# Altium project main_board.PrjPCB
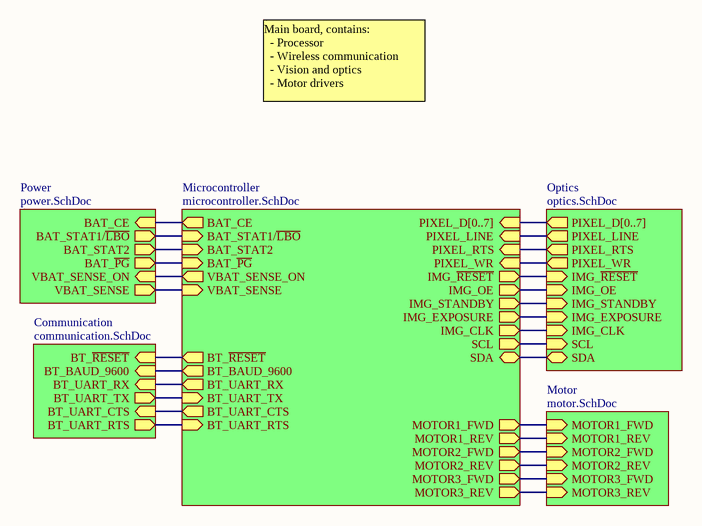
[diagram p0: main_board_interconnect.SchDoc]
6 sheets, 95 parts. Net scope: hierarchical (ports join the sheet entries above them; power ports are global).
Board file: main_board.PcbDoc
Sheets:
  main_board_interconnect.SchDoc
    Microcontroller = microcontroller.SchDoc
    Power = power.SchDoc
    Optics = optics.SchDoc
    Communication = communication.SchDoc
    Motor = motor.SchDoc

## Sheet main_board_interconnect.SchDoc
size A4

### Sub-sheets
Communication = communication.SchDoc: BT_~{RESET} (in), BT_BAUD_9600 (in), BT_UART_RX (in), BT_UART_TX (out), BT_UART_CTS (in), BT_UART_RTS (out)
Microcontroller = microcontroller.SchDoc: BAT_CE (out), BAT_STAT1/~{LBO} (in), BAT_STAT2 (in), BAT_~{PG} (in), VBAT_SENSE_ON (out), VBAT_SENSE (in), BT_~{RESET} (out), BT_BAUD_9600 (out), BT_UART_RX (out), BT_UART_TX (in), BT_UART_CTS (out), BT_UART_RTS (in), MOTOR3_REV (out), MOTOR3_FWD (out), MOTOR2_REV (out), MOTOR2_FWD (out), MOTOR1_REV (out), MOTOR1_FWD (out), PIXEL_D[0..7] (in), PIXEL_LINE (in), PIXEL_RTS (in), PIXEL_WR (in), IMG_~{RESET} (out), IMG_OE (out), IMG_STANDBY (out), IMG_EXPOSURE (out), IMG_CLK (out), SDA (bidir), SCL (out)
Motor = motor.SchDoc: MOTOR3_REV (in), MOTOR3_FWD (in), MOTOR2_REV (in), MOTOR2_FWD (in), MOTOR1_REV (in), MOTOR1_FWD (in)
Optics = optics.SchDoc: PIXEL_D[0..7] (out), PIXEL_LINE (out), PIXEL_RTS (out), PIXEL_WR (out), IMG_~{RESET} (in), IMG_OE (in), IMG_STANDBY (in), IMG_EXPOSURE (in), IMG_CLK (in), SDA (bidir), SCL (in)
Power = power.SchDoc: BAT_CE (in), BAT_STAT1/~{LBO} (out), BAT_STAT2 (out), BAT_~{PG} (out), VBAT_SENSE_ON (in), VBAT_SENSE (out)

### Nets
IMG_CLK: sheet Microcontroller/IMG_CLK, sheet Optics/IMG_CLK
IMG_EXPOSURE: sheet Microcontroller/IMG_EXPOSURE, sheet Optics/IMG_EXPOSURE
PIXEL_WR: sheet Microcontroller/PIXEL_WR, sheet Optics/PIXEL_WR
SCL: sheet Microcontroller/SCL, sheet Optics/SCL
SDA: sheet Microcontroller/SDA, sheet Optics/SDA
NetIC1_4: sheet Microcontroller/BT_BAUD_9600, sheet Communication/BT_BAUD_9600
NetIC1_5: sheet Microcontroller/BT_~{RESET}, sheet Communication/BT_~{RESET}
NetIC1_13: sheet Microcontroller/BT_UART_RX, sheet Communication/BT_UART_RX
NetIC1_14: sheet Microcontroller/BT_UART_TX, sheet Communication/BT_UART_TX
NetIC1_15: sheet Microcontroller/BT_UART_RTS, sheet Communication/BT_UART_RTS
NetIC1_16: sheet Microcontroller/BT_UART_CTS, sheet Communication/BT_UART_CTS
NetIC2_11: sheet Microcontroller/BAT_~{PG}, sheet Power/BAT_~{PG}
NetIC2_12: sheet Microcontroller/BAT_STAT2, sheet Power/BAT_STAT2
NetIC2_13: sheet Microcontroller/BAT_STAT1/~{LBO}, sheet Power/BAT_STAT1/~{LBO}
NetIC2_14: sheet Microcontroller/MOTOR1_FWD, sheet Motor/MOTOR1_FWD
NetIC2_17: sheet Microcontroller/MOTOR1_REV, sheet Motor/MOTOR1_REV
NetIC2_18: sheet Microcontroller/MOTOR2_FWD, sheet Motor/MOTOR2_FWD
NetIC2_21: sheet Microcontroller/MOTOR2_REV, sheet Motor/MOTOR2_REV
NetIC2_22: sheet Microcontroller/MOTOR3_FWD, sheet Motor/MOTOR3_FWD
NetIC2_23: sheet Microcontroller/MOTOR3_REV, sheet Motor/MOTOR3_REV
NetIC2_24: sheet Microcontroller/VBAT_SENSE, sheet Power/VBAT_SENSE
NetIC2_27: sheet Microcontroller/VBAT_SENSE_ON, sheet Power/VBAT_SENSE_ON
NetIC2_28: sheet Microcontroller/BAT_CE, sheet Power/BAT_CE
NetIC2_45: sheet Microcontroller/PIXEL_RTS, sheet Optics/PIXEL_RTS
NetIC2_46: sheet Microcontroller/IMG_OE, sheet Optics/IMG_OE
NetIC2_50: sheet Microcontroller/IMG_~{RESET}, sheet Optics/IMG_~{RESET}
NetIC2_56: sheet Microcontroller/IMG_STANDBY, sheet Optics/IMG_STANDBY
NetIC2_57: sheet Microcontroller/PIXEL_LINE, sheet Optics/PIXEL_LINE

### Buses and harness runs
bus sheet Microcontroller/PIXEL_D[0..7] = sheet Optics/PIXEL_D[0..7]

### Notes on the sheet
- Main board, contains:
  - Processor
  - Wireless communication
  - Vision and optics
  - Motor drivers

## Sheet microcontroller.SchDoc
size A4
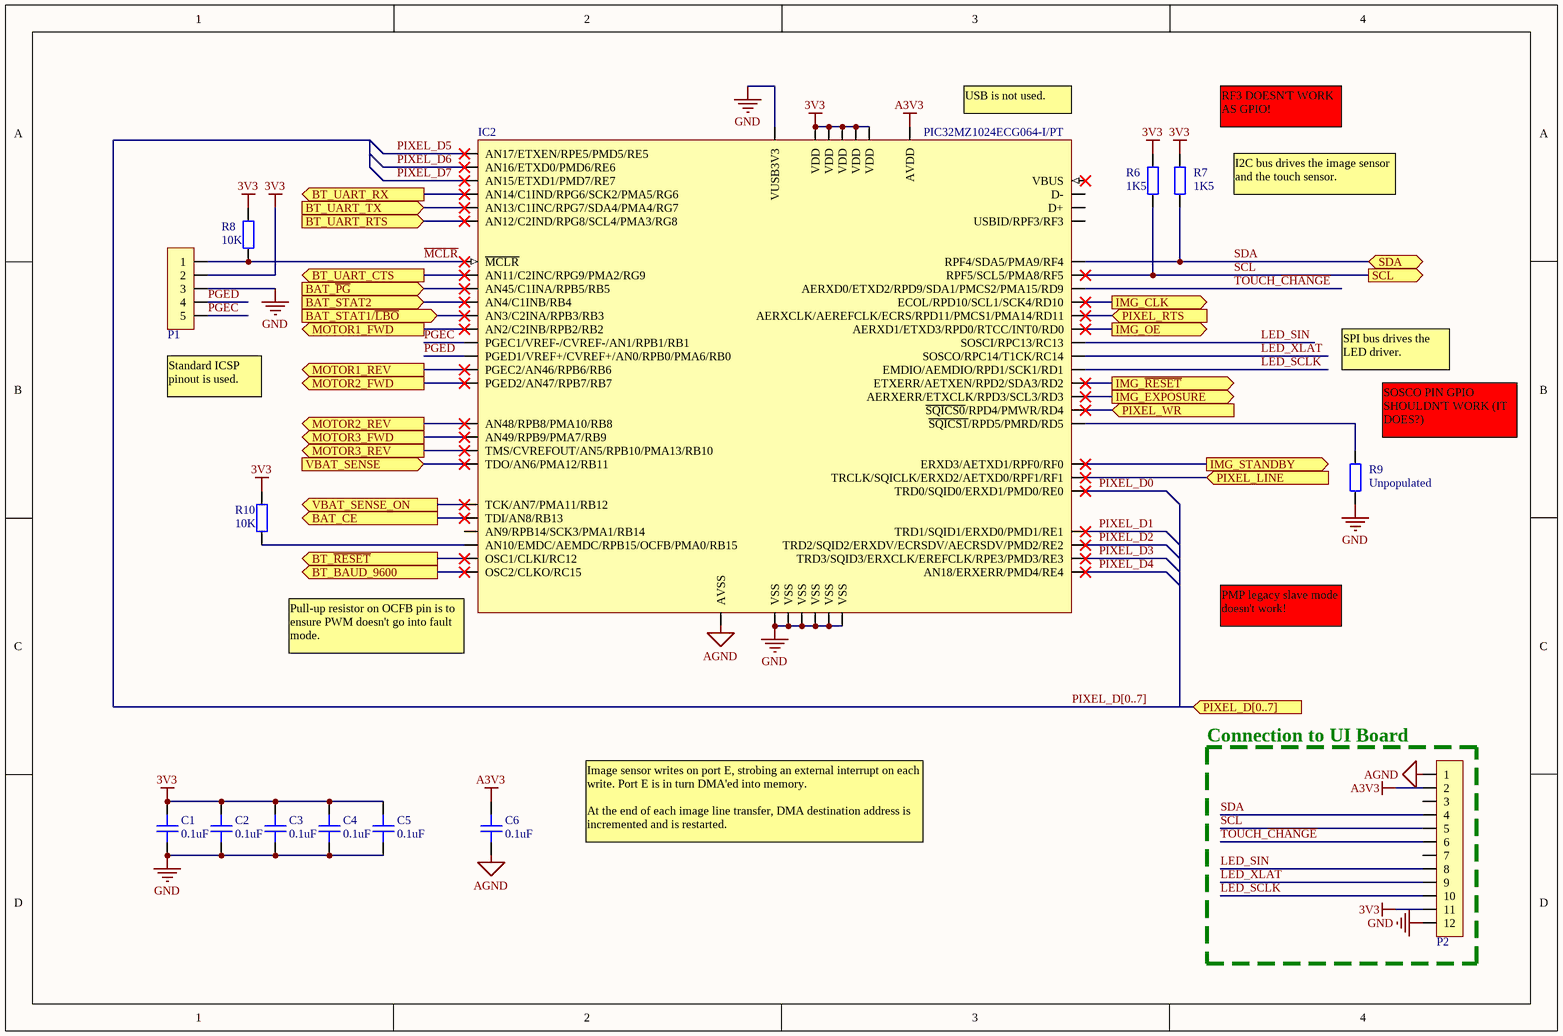
[diagram p1: microcontroller.SchDoc]

### Parts
C1  0.1uF  [1608[0603]_M]
C2  0.1uF  [1608[0603]_M]
C3  0.1uF  [1608[0603]_M]
C4  0.1uF  [1608[0603]_M]
C5  0.1uF  [1608[0603]_M]
C6  0.1uF  [1608[0603]_M]
IC2  PIC32MZ1024ECG064-I/PT  [TQFP-64_M]
P1  Connector 5  [BM05B-SRSS_N]  (value not drawn)
P2  Connector 12  [FH33-12S-0.5SH_N]  (value not drawn)
R6  1K5  [1608[0603]_M]
R7  1K5  [1608[0603]_M]
R8  10K  [1608[0603]_M]
R9  Unpopulated  [1608[0603]_M]
R10  10K  [1608[0603]_M]

### Blocks framed on the sheet
Connection to UI Board: P2

### Ports
BAT_CE (out), BAT_STAT1/~{LBO} (in), BAT_STAT2 (in), BAT_~{PG} (in), BT_BAUD_9600 (out), BT_UART_CTS (out), BT_UART_RTS (in), BT_UART_RX (out), BT_UART_TX (in), BT_~{RESET} (out), IMG_CLK (out), IMG_EXPOSURE (out), IMG_OE (out), IMG_STANDBY (out), IMG_~{RESET} (out), MOTOR1_FWD (out), MOTOR1_REV (out), MOTOR2_FWD (out), MOTOR2_REV (out), MOTOR3_FWD (out), MOTOR3_REV (out), PIXEL_D[0..7] (in), PIXEL_LINE (in), PIXEL_RTS (in), PIXEL_WR (in), SCL (out), SDA (bidir), VBAT_SENSE (in), VBAT_SENSE_ON (out)

### Nets
3V3: C1.2 C2.2 C3.2 C4.2 C5.2 IC2.8(VDD) IC2.26(VDD) IC2.39(VDD) IC2.54(VDD) IC2.60(VDD) P1.2 P2.11 R6.2 R7.2 R8.2 R10.2
A3V3: C6.2 IC2.19(AVDD) P2.2
AGND: C6.1 IC2.20(AVSS) P2.1
GND: C1.1 C2.1 C3.1 C4.1 C5.1 IC2.7(VSS) IC2.25(VSS) IC2.34(VUSB3V3) IC2.35(VSS) IC2.40(VSS) IC2.55(VSS) IC2.59(VSS) P1.3 P2.12 R9.1
IMG_CLK: IC2.44(ECOL/RPD10/SCL1/SCK4/RD10) ; port IMG_CLK
IMG_EXPOSURE: IC2.51(AERXERR/ETXCLK/RPD3/SCL3/RD3) ; port IMG_EXPOSURE
LED_SCLK: IC2.49(EMDIO/AEMDIO/RPD1/SCK1/RD1) P2.10
LED_SIN: IC2.47(SOSCI/RPC13/RC13) P2.8
LED_XLAT: IC2.48(SOSCO/RPC14/T1CK/RC14) P2.9
~{MCLR}: IC2.9(~{MCLR}) P1.1 R8.1
PGEC: IC2.15(PGEC1/VREF-/CVREF-/AN1/RPB1/RB1) P1.5
PGED: IC2.16(PGED1/VREF+/CVREF+/AN0/RPB0/PMA6/RB0) P1.4
PIXEL_D0: IC2.58(TRD0/SQID0/ERXD1/PMD0/RE0)
PIXEL_D1: IC2.61(TRD1/SQID1/ERXD0/PMD1/RE1)
PIXEL_D2: IC2.62(TRD2/SQID2/ERXDV/ECRSDV/AECRSDV/PMD2/RE2)
PIXEL_D3: IC2.63(TRD3/SQID3/ERXCLK/EREFCLK/RPE3/PMD3/RE3)
PIXEL_D4: IC2.64(AN18/ERXERR/PMD4/RE4)
PIXEL_D5: IC2.1(AN17/ETXEN/RPE5/PMD5/RE5)
PIXEL_D6: IC2.2(AN16/ETXD0/PMD6/RE6)
PIXEL_D7: IC2.3(AN15/ETXD1/PMD7/RE7)
PIXEL_WR: IC2.52(~{SQICS0}/RPD4/PMWR/RD4) ; port PIXEL_WR
SCL: IC2.42(RPF5/SCL5/PMA8/RF5) P2.5 R6.1 ; port SCL
SDA: IC2.41(RPF4/SDA5/PMA9/RF4) P2.4 R7.1 ; port SDA
TOUCH_~{CHANGE}: IC2.43(AERXD0/ETXD2/RPD9/SDA1/PMCS2/PMA15/RD9) P2.6
NetIC1_4: IC2.32(OSC2/CLKO/RC15) ; port BT_BAUD_9600
NetIC1_5: IC2.31(OSC1/CLKI/RC12) ; port BT_~{RESET}
NetIC1_13: IC2.4(AN14/C1IND/RPG6/SCK2/PMA5/RG6) ; port BT_UART_RX
NetIC1_14: IC2.5(AN13/C1INC/RPG7/SDA4/PMA4/RG7) ; port BT_UART_TX
NetIC1_15: IC2.6(AN12/C2IND/RPG8/SCL4/PMA3/RG8) ; port BT_UART_RTS
NetIC1_16: IC2.10(AN11/C2INC/RPG9/PMA2/RG9) ; port BT_UART_CTS
NetIC2_11: IC2.11(AN45/C1INA/RPB5/RB5) ; port BAT_~{PG}
NetIC2_12: IC2.12(AN4/C1INB/RB4) ; port BAT_STAT2
NetIC2_13: IC2.13(AN3/C2INA/RPB3/RB3) ; port BAT_STAT1/~{LBO}
NetIC2_14: IC2.14(AN2/C2INB/RPB2/RB2) ; port MOTOR1_FWD
NetIC2_17: IC2.17(PGEC2/AN46/RPB6/RB6) ; port MOTOR1_REV
NetIC2_18: IC2.18(PGED2/AN47/RPB7/RB7) ; port MOTOR2_FWD
NetIC2_21: IC2.21(AN48/RPB8/PMA10/RB8) ; port MOTOR2_REV
NetIC2_22: IC2.22(AN49/RPB9/PMA7/RB9) ; port MOTOR3_FWD
NetIC2_23: IC2.23(TMS/CVREFOUT/AN5/RPB10/PMA13/RB10) ; port MOTOR3_REV
NetIC2_24: IC2.24(TDO/AN6/PMA12/RB11) ; port VBAT_SENSE
NetIC2_27: IC2.27(TCK/AN7/PMA11/RB12) ; port VBAT_SENSE_ON
NetIC2_28: IC2.28(TDI/AN8/RB13) ; port BAT_CE
NetIC2_30: IC2.30(AN10/EMDC/AEMDC/RPB15/OCFB/PMA0/RB15) R10.1
NetIC2_45: IC2.45(AERXCLK/AEREFCLK/ECRS/RPD11/PMCS1/PMA14/RD11) ; port PIXEL_RTS
NetIC2_46: IC2.46(AERXD1/ETXD3/RPD0/RTCC/INT0/RD0) ; port IMG_OE
NetIC2_50: IC2.50(ETXERR/AETXEN/RPD2/SDA3/RD2) ; port IMG_~{RESET}
NetIC2_53: IC2.53(~{SQICS1}/RPD5/PMRD/RD5) R9.2
NetIC2_56: IC2.56(ERXD3/AETXD1/RPF0/RF0) ; port IMG_STANDBY
NetIC2_57: IC2.57(TRCLK/SQICLK/ERXD2/AETXD0/RPF1/RF1) ; port PIXEL_LINE

Not connected (* = marked no-connect by the designer): IC2 29(AN9/RPB14/SCK3/PMA1/RB14) 33(VBUS)* 36(D-) 37(D+) 38(USBID/RPF3/RF3); P2 3 7

### Buses and harness runs
bus PIXEL_D[0..7] = port PIXEL_D[0..7]

### Notes on the sheet
- (near IC2) USB is not used.
- RF3 DOESN'T WORK AS GPIO!
- I2C bus drives the image sensor and the touch sensor.
- SPI bus drives the LED driver.
- (near P1) Standard ICSP pinout is used.
- (near R9) SOSCO PIN GPIO SHOULDN'T WORK (IT DOES?)
- (near IC2) Pull-up resistor on OCFB pin is to ensure PWM doesn't go into fault mode.
- PMP legacy slave mode doesn't work!
- Image sensor writes on port E, strobing an external interrupt on each write. Port E is in turn DMA'ed into memory.
  At the end of each image line transfer, DMA destination address is incremented and is restarted.

### Library data of the parts
C1-C6 = Capacitor: Generic Capacitor; Value: 0.1uF
IC2 = PIC32MZ1024ECG064: 32-bit Microcontroller
P1 = Connector 5: Connector 5-Pin
P2 = Connector 12: Connector 12-Pin
R6-R10 = Resistor: Generic Resistor
  R6 R7: Value: 1K5
  R8 R10: Value: 10K
  R9: Value: Unpopulated

## Sheet power.SchDoc: sadasd
size A4
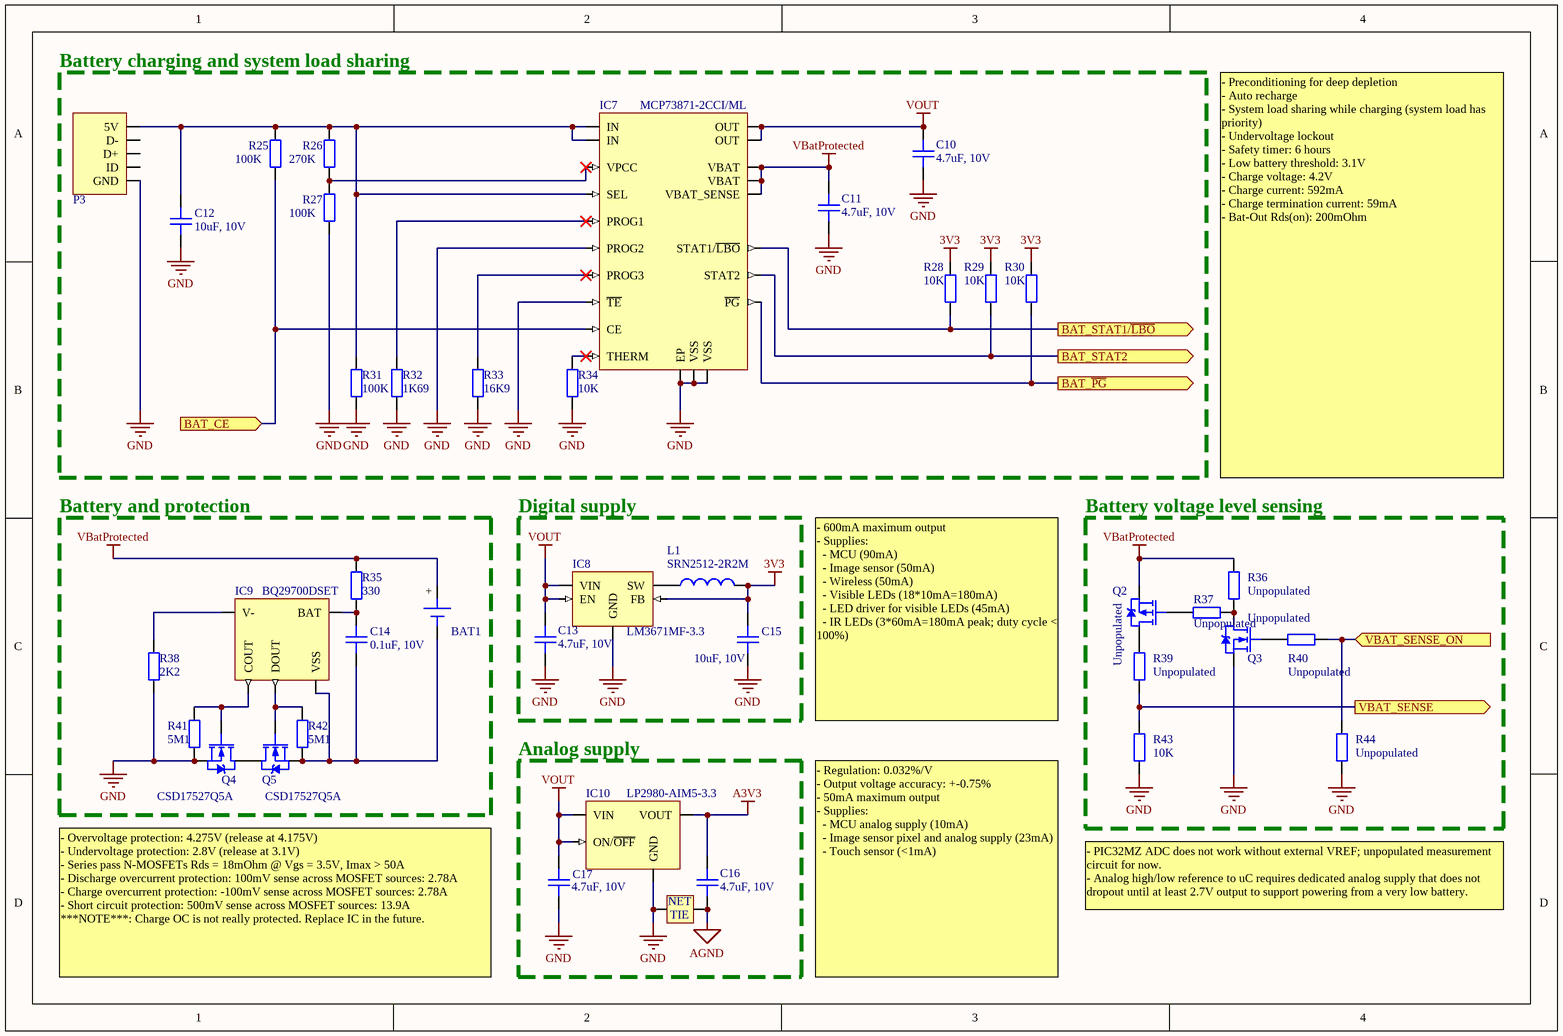
[diagram p2: power.SchDoc]

### Parts
BAT1  Battery_1S  [WAGO 2059-302]  (value not drawn)
C10  4.7uF, 10V  [1608[0603]_M]
C11  4.7uF, 10V  [1608[0603]_M]
C12  10uF, 10V  [1608[0603]_M]
C13  4.7uF, 10V  [1608[0603]_M]
C14  0.1uF, 10V  [1608[0603]_M]
C15  10uF, 10V  [1608[0603]_M]
C16  4.7uF, 10V  [1608[0603]_M]
C17  4.7uF, 10V  [1608[0603]_M]
IC7  MCP73871-2CCI/ML  [QFN-20_M]
IC8  LM3671MF-3.3  [SOT23-5_N]
IC9  BQ29700DSET  [WSON-6_M]
IC10  LP2980-AIM5-3.3  [SOT23-5_N]
L1  SRN2512-2R2M  [2520[1008]_N]
NT1  NET-TIE  [NET-TIE-0.15MM]  (value not drawn)  (net tie, no BOM)
P3  MicroUSB2.0  [USB3076_M]  (value not drawn)
Q2  Unpopulated  [SOT23-3_N]
Q3  Unpopulated  [SOT23-3_N]
Q4  CSD17527Q5A  [PG-TDSON-8_MOSFET_M]
Q5  CSD17527Q5A  [PG-TDSON-8_MOSFET_M]
R25  100K  [1608[0603]_M]
R26  270K  [1608[0603]_M]
R27  100K  [1608[0603]_M]
R28  10K  [1608[0603]_M]
R29  10K  [1608[0603]_M]
R30  10K  [1608[0603]_M]
R31  100K  [1608[0603]_M]
R32  1K69  [1608[0603]_M]
R33  16K9  [1608[0603]_M]
R34  10K  [1608[0603]_M]
R35  330  [1608[0603]_M]
R36  Unpopulated  [1608[0603]_M]
R37  Unpopulated  [1608[0603]_M]
R38  2K2  [1608[0603]_M]
R39  Unpopulated  [1608[0603]_M]
R40  Unpopulated  [1608[0603]_M]
R41  5M1  [1608[0603]_M]
R42  5M1  [1608[0603]_M]
R43  10K  [1608[0603]_M]
R44  Unpopulated  [1608[0603]_M]

### Blocks framed on the sheet
Battery charging and system load sharing: C10-C12 IC7 P3 R25-R34
Battery and protection: BAT1 C14 IC9 Q4 Q5 R35 R38 R41 R42
Digital supply: C13 C15 IC8 L1
Battery voltage level sensing: Q2 Q3 R36 R37 R39 R40 R43 R44
Analog supply: C16 C17 IC10 NT1

### Ports
BAT_CE (in), BAT_STAT1/~{LBO} (out), BAT_STAT2 (out), BAT_~{PG} (out), VBAT_SENSE (out), VBAT_SENSE_ON (in)

### Nets
3V3: C15.2 IC8.4(FB) L1.2 R28.2 R29.2 R30.2
A3V3: C16.2 IC10.5(VOUT)
AGND: C16.1 NT1.2
GND: C10.1 C11.1 C12.1 C13.1 C15.1 C17.1 IC7.4(PROG2) IC7.9(~{TE}) IC7.10(VSS) IC7.11(VSS) IC7.EP IC8.2(GND) IC10.2(GND) NT1.1 P3.5(GND) Q3.S Q4.S R27.1 R31.1 R32.1 R33.1 R34.1 R38.1 R41.1 R43.1 R44.1
VBatProtected: BAT1.+ C11.2 IC7.14(VBAT) IC7.15(VBAT) IC7.16(VBAT_SENSE) Q2.S R35.2 R36.2
VOUT: C10.2 C13.2 C17.2 IC7.1(OUT) IC7.20(OUT) IC8.1(VIN) IC8.3(EN) IC10.1(VIN) IC10.3(ON/~{OFF})
NetBAT1_-: BAT1.- C14.1 IC9.4(VSS) Q5.S R42.1
NetC12_2: C12.2 IC7.3(SEL) IC7.18(IN) IC7.19(IN) P3.1(5V) R25.2 R26.2 R31.2
NetC14_2: C14.2 IC9.5(BAT) R35.1
NetIC2_11: IC7.6(~{PG}) R30.1 ; port BAT_~{PG}
NetIC2_12: IC7.7(STAT2) R29.1 ; port BAT_STAT2
NetIC2_13: IC7.8(STAT1/~{LBO}) R28.1 ; port BAT_STAT1/~{LBO}
NetIC2_24: R39.1 R43.2 ; port VBAT_SENSE
NetIC2_27: R40.2 R44.2 ; port VBAT_SENSE_ON
NetIC2_28: IC7.17(CE) R25.1 ; port BAT_CE
NetIC7_2: IC7.2(VPCC) R26.1 R27.2
NetIC7_5: IC7.5(THERM) R34.2
NetIC7_12: IC7.12(PROG3) R33.2
NetIC7_13: IC7.13(PROG1) R32.2
NetIC8_5: IC8.5(SW) L1.1
NetIC9_2: IC9.2(COUT) Q4.G R41.2
NetIC9_3: IC9.3(DOUT) Q5.G R42.2
NetIC9_6: IC9.6(V-) R38.2
NetQ2_D: Q2.D R39.2
NetQ2_G: Q2.G R37.1
NetQ3_D: Q3.D R36.1 R37.2
NetQ3_G: Q3.G R40.1
NetQ4_D: Q4.D Q5.D

Not connected (* = marked no-connect by the designer): P3 2(D-) 3(D+) 4(ID)

### Notes on the sheet
- - Preconditioning for deep depletion
  - Auto recharge
  - System load sharing while charging (system load has priority)
  - Undervoltage lockout
  - Safety timer: 6 hours
  - Low battery threshold: 3.1V
  - Charge voltage: 4.2V
  - Charge current: 592mA
  - Charge termination current: 59mA
  - Bat-Out Rds(on): 200mOhm
- - 600mA maximum output
  - Supplies:
  - MCU (90mA)
  - Image sensor (50mA)
  - Wireless (50mA)
  - Visible LEDs (18*10mA=180mA)
  - LED driver for visible LEDs (45mA)
  - IR LEDs (3*60mA=180mA peak; duty cycle < 100%)
- - PIC32MZ ADC does not work without external VREF; unpopulated measurement circuit for now.
  - Analog high/low reference to uC requires dedicated analog supply that does not dropout until at least 2.7V output to support powering from a very low battery.
- - Overvoltage protection: 4.275V (release at 4.175V)
  - Undervoltage protection: 2.8V (release at 3.1V)
  - Series pass N-MOSFETs Rds = 18mOhm @ Vgs = 3.5V, Imax > 50A
  - Discharge overcurrent protection: 100mV sense across MOSFET sources: 2.78A
  - Charge overcurrent protection: -100mV sense across MOSFET sources: 2.78A
  - Short circuit protection: 500mV sense across MOSFET sources: 13.9A
  ***NOTE***: Charge OC is not really protected. Replace IC in the future.
- - Regulation: 0.032%/V
  - Output voltage accuracy: +-0.75%
  - 50mA maximum output
  - Supplies:
  - MCU analog supply (10mA)
  - Image sensor pixel and analog supply (23mA)
  - Touch sensor (<1mA)
- (in symbol NET-TIE) NET; TIE

### Library data of the parts
BAT1 = Battery_1S: Generic single cell battery; pin to pad: +>1 ->2
C10-C17 = Capacitor: Generic Capacitor
  C10 C11 C13 C16 C17: Value: 4.7uF, 10V
  C12 C15: Value: 10uF, 10V
  C14: Value: 0.1uF, 10V
IC7 = MCP73871-2CCI/ML: Li-Po battery charge controller with system load sharing
IC8 = LM3671: 2MHz, 600mA step-down converter
IC9 = BQ29700: Li-Po battery voltage and current protection
IC10 = LP2980-N: 50 mA, ultra low drop-out voltage regulator
L1 = Inductor: Value: 2.2uH
NT1 = NET-TIE: Generic net tie
P3 = MicroUSB2.0: Micro USB 2.0 plug/receptacle, 5-Leads
Q2 = MOSFET-P_BodyDiode: P-channel MOSFET with body diode drawn; pin to pad: D>3 G>1 S>2
Q3 = MOSFET-N_BodyDiode: N-channel MOSFET with body diode drawn; pin to pad: D>3 G>1 S>2
Q4 Q5 = MOSFET-N_BodyDiode: N-channel MOSFET with body diode drawn
R25-R44 = Resistor: Generic Resistor
  R25 R27 R31: Value: 100K
  R26: Value: 270K
  R28-R30 R34 R43: Value: 10K
  R32: Value: 1K69
  R33: Value: 16K9
  R35: Value: 330
  R36 R37 R39 R40 R44: Value: Unpopulated
  R38: Value: 2K2
  R41 R42: Value: 5M1

## Sheet optics.SchDoc
size A4
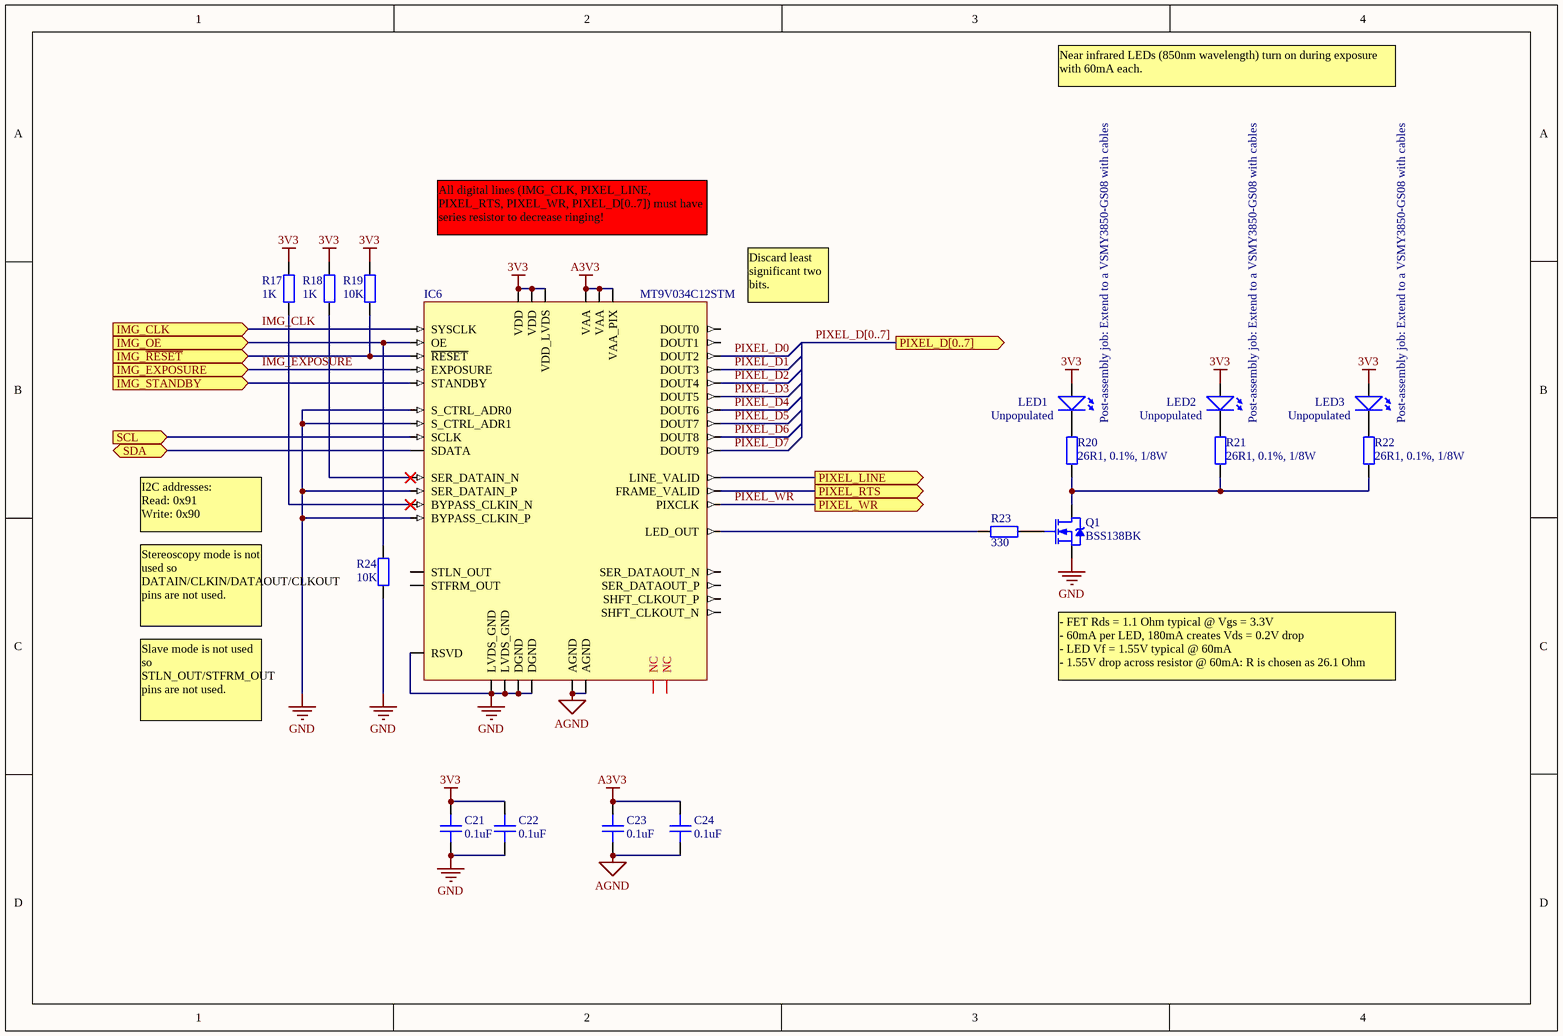
[diagram p3: optics.SchDoc]

### Parts
C21  0.1uF  [1608[0603]_M]
C22  0.1uF  [1608[0603]_M]
C23  0.1uF  [1608[0603]_M]
C24  0.1uF  [1608[0603]_M]
IC6  MT9V034C12STM  [CLCC-48_m]
LED1  Unpopulated  Post-assembly job: Extend to a VSMY3850-GS08 with cables  [PLCC2_WITH_HEATSINK]
LED2  Unpopulated  Post-assembly job: Extend to a VSMY3850-GS08 with cables  [PLCC2_WITH_HEATSINK]
LED3  Unpopulated  Post-assembly job: Extend to a VSMY3850-GS08 with cables  [PLCC2_WITH_HEATSINK]
Q1  BSS138BK  [SOT23-3_N]
R17  1K  [1608[0603]_M]
R18  1K  [1608[0603]_M]
R19  10K  [1608[0603]_M]
R20  26R1, 0.1%, 1/8W  [2012[0805]_M]
R21  26R1, 0.1%, 1/8W  [2012[0805]_M]
R22  26R1, 0.1%, 1/8W  [2012[0805]_M]
R23  330  [1608[0603]_M]
R24  10K  [1608[0603]_M]

### Ports
IMG_CLK (in), IMG_EXPOSURE (in), IMG_OE (in), IMG_STANDBY (in), IMG_~{RESET} (in), PIXEL_D[0..7] (out), PIXEL_LINE (out), PIXEL_RTS (out), PIXEL_WR (out), SCL (in), SDA (bidir)

### Nets
3V3: C21.2 C22.2 IC6.1(VDD) IC6.6(VDD_LVDS) IC6.14(VDD) LED1.A LED2.A LED3.A R17.2 R18.2 R19.2
A3V3: C23.2 C24.2 IC6.35(VAA) IC6.39(VAA) IC6.40(VAA_PIX)
AGND: C23.1 C24.1 IC6.34(AGND) IC6.38(AGND)
GND: C21.1 C22.1 IC6.7(LVDS_GND) IC6.9(BYPASS_CLKIN_P) IC6.11(SER_DATAIN_P) IC6.12(LVDS_GND) IC6.13(DGND) IC6.29(RSVD) IC6.30(S_CTRL_ADR0) IC6.31(S_CTRL_ADR1) IC6.48(DGND) Q1.S R24.1
IMG_CLK: IC6.47(SYSCLK) ; port IMG_CLK
IMG_EXPOSURE: IC6.23(EXPOSURE) ; port IMG_EXPOSURE
PIXEL_D0: IC6.43(DOUT2)
PIXEL_D1: IC6.42(DOUT3)
PIXEL_D2: IC6.41(DOUT4)
PIXEL_D3: IC6.15(DOUT5)
PIXEL_D4: IC6.16(DOUT6)
PIXEL_D5: IC6.17(DOUT7)
PIXEL_D6: IC6.18(DOUT8)
PIXEL_D7: IC6.19(DOUT9)
PIXEL_WR: IC6.46(PIXCLK) ; port PIXEL_WR
SCL: IC6.25(SCLK) ; port SCL
SDA: IC6.24(SDATA) ; port SDA
NetIC2_45: IC6.21(FRAME_VALID) ; port PIXEL_RTS
NetIC2_46: IC6.28(OE) R24.2 ; port IMG_OE
NetIC2_50: IC6.32(~{RESET}) R19.1 ; port IMG_~{RESET}
NetIC2_56: IC6.33(STANDBY) ; port IMG_STANDBY
NetIC2_57: IC6.20(LINE_VALID) ; port PIXEL_LINE
NetIC6_8: IC6.8(BYPASS_CLKIN_N) R17.1
NetIC6_10: IC6.10(SER_DATAIN_N) R18.1
NetIC6_27: IC6.27(LED_OUT) R23.1
NetLED1_K: LED1.K R20.2
NetLED2_K: LED2.K R21.2
NetLED3_K: LED3.K R22.2
NetQ1_D: Q1.D R20.1 R21.1 R22.1
NetQ1_G: Q1.G R23.2

Not connected (* = marked no-connect by the designer): IC6 2(SHFT_CLKOUT_N) 3(SHFT_CLKOUT_P) 4(SER_DATAOUT_P) 5(SER_DATAOUT_N) 22(STLN_OUT) 26(STFRM_OUT) 36(NC) 37(NC) 44(DOUT1) 45(DOUT0)

### Buses and harness runs
bus PIXEL_D[0..7] = port PIXEL_D[0..7]

### Notes on the sheet
- Near infrared LEDs (850nm wavelength) turn on during exposure with 60mA each.
- All digital lines (IMG_CLK, PIXEL_LINE, PIXEL_RTS, PIXEL_WR, PIXEL_D[0..7]) must have series resistor to decrease ringing!
- (near IC6) Discard least significant two bits.
- I2C addresses:
  Read: 0x91
  Write: 0x90
- Stereoscopy mode is not used so DATAIN/CLKIN/DATAOUT/CLKOUT pins are not used.
- Slave mode is not used so STLN_OUT/STFRM_OUT pins are not used.
- - FET Rds = 1.1 Ohm typical @ Vgs = 3.3V
  - 60mA per LED, 180mA creates Vds = 0.2V drop
  - LED Vf = 1.55V typical @ 60mA
  - 1.55V drop across resistor @ 60mA: R is chosen as 26.1 Ohm

### Library data of the parts
C21-C24 = Capacitor: Generic Capacitor; Value: 0.1uF
IC6 = MT9V034C12STM: 1/3" WVGA CMOS Image Sensor
LED1-LED3 = LED: Generic LED; pin to pad: A>1 K>2; Value: Unpopulated
Q1 = MOSFET-N_BodyDiode: N-channel MOSFET with body diode drawn; pin to pad: D>3 G>1 S>2
R17-R24 = Resistor: Generic Resistor
  R17 R18: Value: 1K
  R19 R24: Value: 10K
  R20-R22: Value: 26R1, 0.1%, 1/8W
  R23: Value: 330

## Sheet communication.SchDoc
size A4
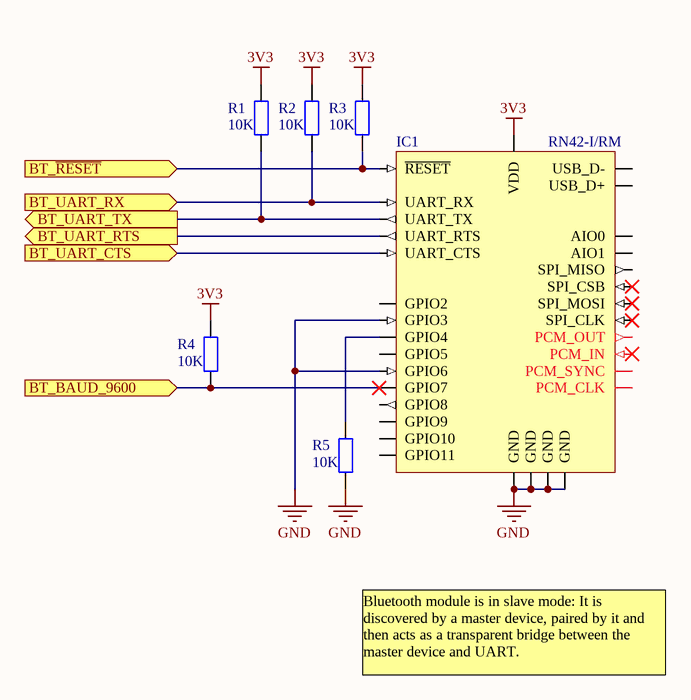
[diagram p4: communication.SchDoc]

### Parts
IC1  RN42-I/RM  [RN42]
R1  10K  [1608[0603]_M]
R2  10K  [1608[0603]_M]
R3  10K  [1608[0603]_M]
R4  10K  [1608[0603]_M]
R5  10K  [1608[0603]_M]

### Ports
BT_BAUD_9600 (in), BT_UART_CTS (in), BT_UART_RTS (out), BT_UART_RX (in), BT_UART_TX (out), BT_~{RESET} (in)

### Nets
3V3: IC1.11(VDD) R1.2 R2.2 R3.2 R4.2
GND: IC1.1(GND) IC1.3(GPIO6) IC1.12(GND) IC1.20(GPIO3) IC1.28(GND) IC1.29(GND) R5.1
NetIC1_4: IC1.4(GPIO7) R4.1 ; port BT_BAUD_9600
NetIC1_5: IC1.5(~{RESET}) R3.1 ; port BT_~{RESET}
NetIC1_13: IC1.13(UART_RX) R2.1 ; port BT_UART_RX
NetIC1_14: IC1.14(UART_TX) R1.1 ; port BT_UART_TX
NetIC1_15: IC1.15(UART_RTS) ; port BT_UART_RTS
NetIC1_16: IC1.16(UART_CTS) ; port BT_UART_CTS
NetIC1_22: IC1.22(GPIO4) R5.2

Not connected (* = marked no-connect by the designer): IC1 2(SPI_MOSI)* 6(SPI_CLK)* 7(PCM_CLK) 8(PCM_SYNC) 9(PCM_IN)* 10(PCM_OUT) 17(USB_D+) 18(USB_D-) 19(GPIO2) 21(GPIO5) 23(SPI_CSB)* 24(SPI_MISO) 30(AIO0) 31(GPIO8) 32(GPIO9) 33(GPIO10) 34(GPIO11) 35(AIO1)

### Notes on the sheet
- Bluetooth module is in slave mode: It is discovered by a master device, paired by it and then acts as a transparent bridge between the master device and UART.

### Library data of the parts
IC1 = RN42: Bluetooth 2.1 module
R1-R5 = Resistor: Generic Resistor; Value: 10K

## Sheet motor.SchDoc
size A4
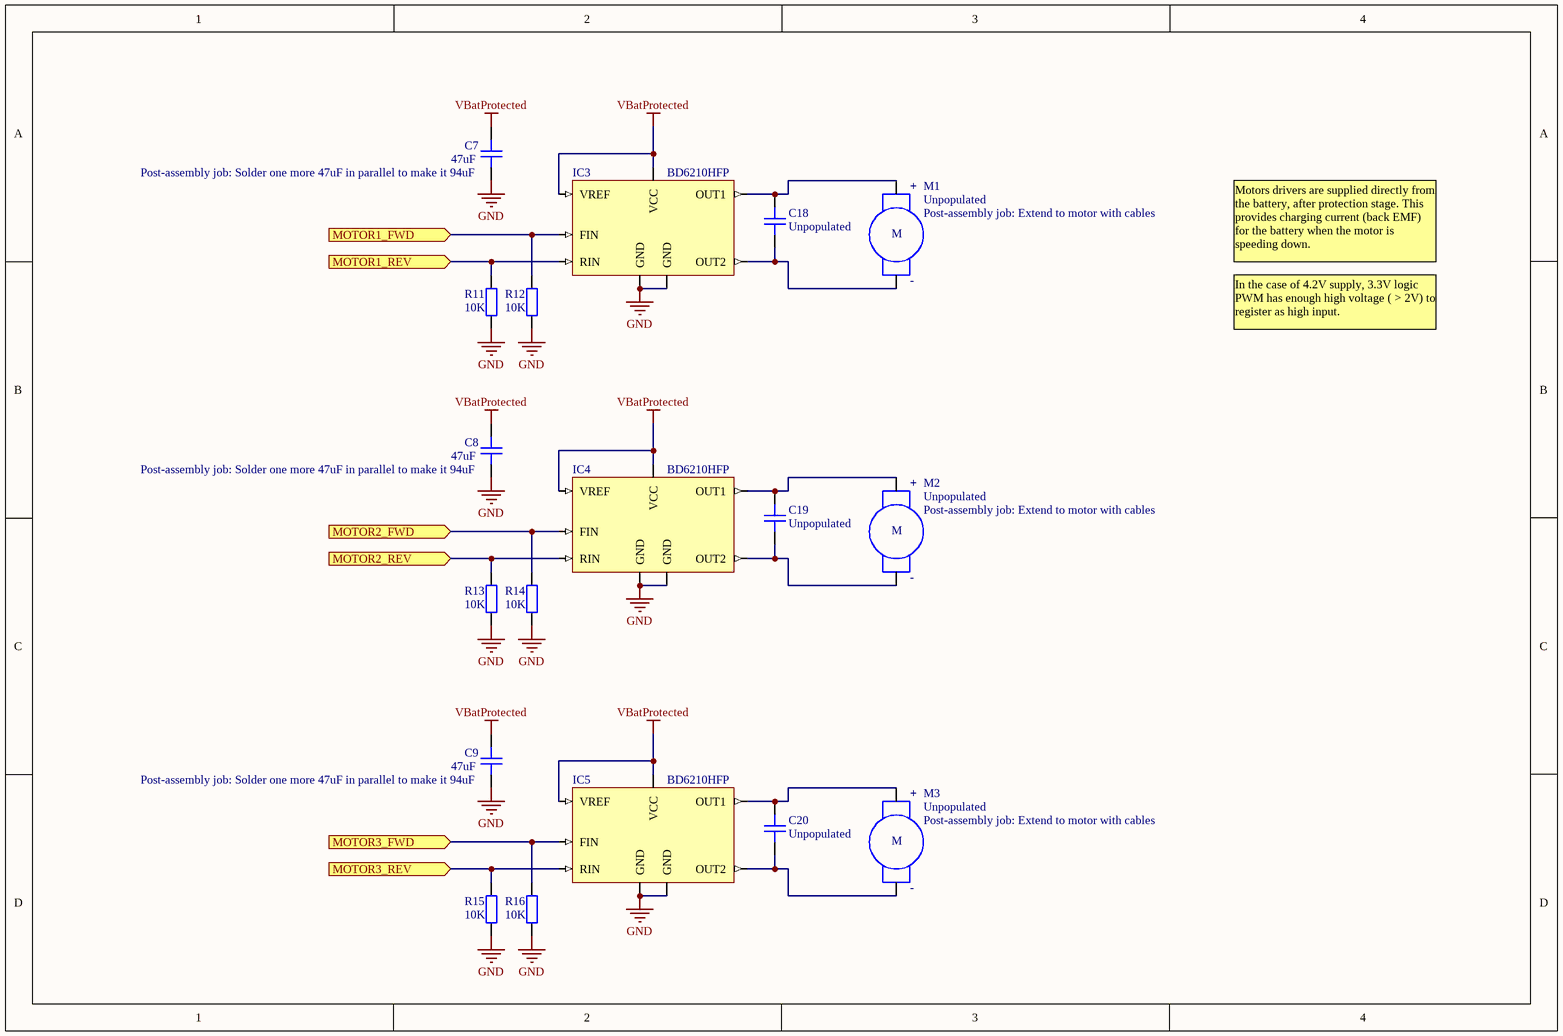
[diagram p5: motor.SchDoc]

### Parts
C7  47uF  Post-assembly job: Solder one more 47uF in parallel to make it 94uF  [2012[0805]_M]
C8  47uF  Post-assembly job: Solder one more 47uF in parallel to make it 94uF  [2012[0805]_M]
C9  47uF  Post-assembly job: Solder one more 47uF in parallel to make it 94uF  [2012[0805]_M]
C18  Unpopulated  [2012[0805]_M]
C19  Unpopulated  [2012[0805]_M]
C20  Unpopulated  [2012[0805]_M]
IC3  BD6210HFP  [HRP7_N]
IC4  BD6210HFP  [HRP7_N]
IC5  BD6210HFP  [HRP7_N]
M1  Unpopulated  Post-assembly job: Extend to motor with cables  [CABLE-TERMINAL1x2]
M2  Unpopulated  Post-assembly job: Extend to motor with cables  [CABLE-TERMINAL1x2]
M3  Unpopulated  Post-assembly job: Extend to motor with cables  [CABLE-TERMINAL1x2]
R11  10K  [1608[0603]_M]
R12  10K  [1608[0603]_M]
R13  10K  [1608[0603]_M]
R14  10K  [1608[0603]_M]
R15  10K  [1608[0603]_M]
R16  10K  [1608[0603]_M]

### Ports
MOTOR1_FWD (in), MOTOR1_REV (in), MOTOR2_FWD (in), MOTOR2_REV (in), MOTOR3_FWD (in), MOTOR3_REV (in)

### Nets
GND: C7.1 C8.1 C9.1 IC3.4(GND) IC3.Heatsink(GND) IC4.4(GND) IC4.Heatsink(GND) IC5.4(GND) IC5.Heatsink(GND) R11.1 R12.1 R13.1 R14.1 R15.1 R16.1
VBatProtected: C7.2 C8.2 C9.2 IC3.1(VREF) IC3.7(VCC) IC4.1(VREF) IC4.7(VCC) IC5.1(VREF) IC5.7(VCC)
NetC18_1: C18.1 IC3.6(OUT2) M1.-
NetC18_2: C18.2 IC3.2(OUT1) M1.+
NetC19_1: C19.1 IC4.6(OUT2) M2.-
NetC19_2: C19.2 IC4.2(OUT1) M2.+
NetC20_1: C20.1 IC5.6(OUT2) M3.-
NetC20_2: C20.2 IC5.2(OUT1) M3.+
NetIC2_14: IC3.3(FIN) R12.2 ; port MOTOR1_FWD
NetIC2_17: IC3.5(RIN) R11.2 ; port MOTOR1_REV
NetIC2_18: IC4.3(FIN) R14.2 ; port MOTOR2_FWD
NetIC2_21: IC4.5(RIN) R13.2 ; port MOTOR2_REV
NetIC2_22: IC5.3(FIN) R16.2 ; port MOTOR3_FWD
NetIC2_23: IC5.5(RIN) R15.2 ; port MOTOR3_REV

### Notes on the sheet
- Motors drivers are supplied directly from the battery, after protection stage. This provides charging current (back EMF) for the battery when the motor is speeding down.
- In the case of 4.2V supply, 3.3V logic PWM has enough high voltage ( > 2V) to register as high input.
- (in symbol DCMotor) M

### Library data of the parts
C7-C9 C18-C20 = Capacitor: Generic Capacitor
  C7-C9: Value: 47uF
  C18-C20: Value: Unpopulated
IC3-IC5 = BD621xHFP: DC Motor driver, full H-bridge
M1-M3 = DCMotor: Generic DC motor; pin to pad: +>1 ->2
R11-R16 = Resistor: Generic Resistor; Value: 10K

## Nets that join several sheets
3V3: microcontroller (16 pins), power (6 pins), optics (11 pins), communication (5 pins)
A3V3: microcontroller (C6.2 IC2.19 P2.2), power (C16.2 IC10.5), optics (5 pins)
AGND: microcontroller (C6.1 IC2.20 P2.1), power (C16.1 NT1.2), optics (C23.1 C24.1 IC6.34 IC6.38)
GND: microcontroller (15 pins), power (26 pins), optics (13 pins), communication (7 pins), motor (15 pins)
VBatProtected: power (8 pins), motor (9 pins)
IMG_CLK: microcontroller (IC2.44), optics (IC6.47)
IMG_EXPOSURE: microcontroller (IC2.51), optics (IC6.23)
NetIC1_4: microcontroller (IC2.32), communication (IC1.4 R4.1)
NetIC1_5: microcontroller (IC2.31), communication (IC1.5 R3.1)
NetIC1_13: microcontroller (IC2.4), communication (IC1.13 R2.1)
NetIC1_14: microcontroller (IC2.5), communication (IC1.14 R1.1)
NetIC1_15: microcontroller (IC2.6), communication (IC1.15)
NetIC1_16: microcontroller (IC2.10), communication (IC1.16)
NetIC2_11: microcontroller (IC2.11), power (IC7.6 R30.1)
NetIC2_12: microcontroller (IC2.12), power (IC7.7 R29.1)
NetIC2_13: microcontroller (IC2.13), power (IC7.8 R28.1)
NetIC2_14: microcontroller (IC2.14), motor (IC3.3 R12.2)
NetIC2_17: microcontroller (IC2.17), motor (IC3.5 R11.2)
NetIC2_18: microcontroller (IC2.18), motor (IC4.3 R14.2)
NetIC2_21: microcontroller (IC2.21), motor (IC4.5 R13.2)
NetIC2_22: microcontroller (IC2.22), motor (IC5.3 R16.2)
NetIC2_23: microcontroller (IC2.23), motor (IC5.5 R15.2)
NetIC2_24: microcontroller (IC2.24), power (R39.1 R43.2)
NetIC2_27: microcontroller (IC2.27), power (R40.2 R44.2)
NetIC2_28: microcontroller (IC2.28), power (IC7.17 R25.1)
NetIC2_45: microcontroller (IC2.45), optics (IC6.21)
NetIC2_46: microcontroller (IC2.46), optics (IC6.28 R24.2)
NetIC2_50: microcontroller (IC2.50), optics (IC6.32 R19.1)
NetIC2_56: microcontroller (IC2.56), optics (IC6.33)
NetIC2_57: microcontroller (IC2.57), optics (IC6.20)
PIXEL_D0: microcontroller (IC2.58), optics (IC6.43)
PIXEL_D1: microcontroller (IC2.61), optics (IC6.42)
PIXEL_D2: microcontroller (IC2.62), optics (IC6.41)
PIXEL_D3: microcontroller (IC2.63), optics (IC6.15)
PIXEL_D4: microcontroller (IC2.64), optics (IC6.16)
PIXEL_D5: microcontroller (IC2.1), optics (IC6.17)
PIXEL_D6: microcontroller (IC2.2), optics (IC6.18)
PIXEL_D7: microcontroller (IC2.3), optics (IC6.19)
PIXEL_WR: microcontroller (IC2.52), optics (IC6.46)
SCL: microcontroller (IC2.42 P2.5 R6.1), optics (IC6.25)
SDA: microcontroller (IC2.41 P2.4 R7.1), optics (IC6.24)